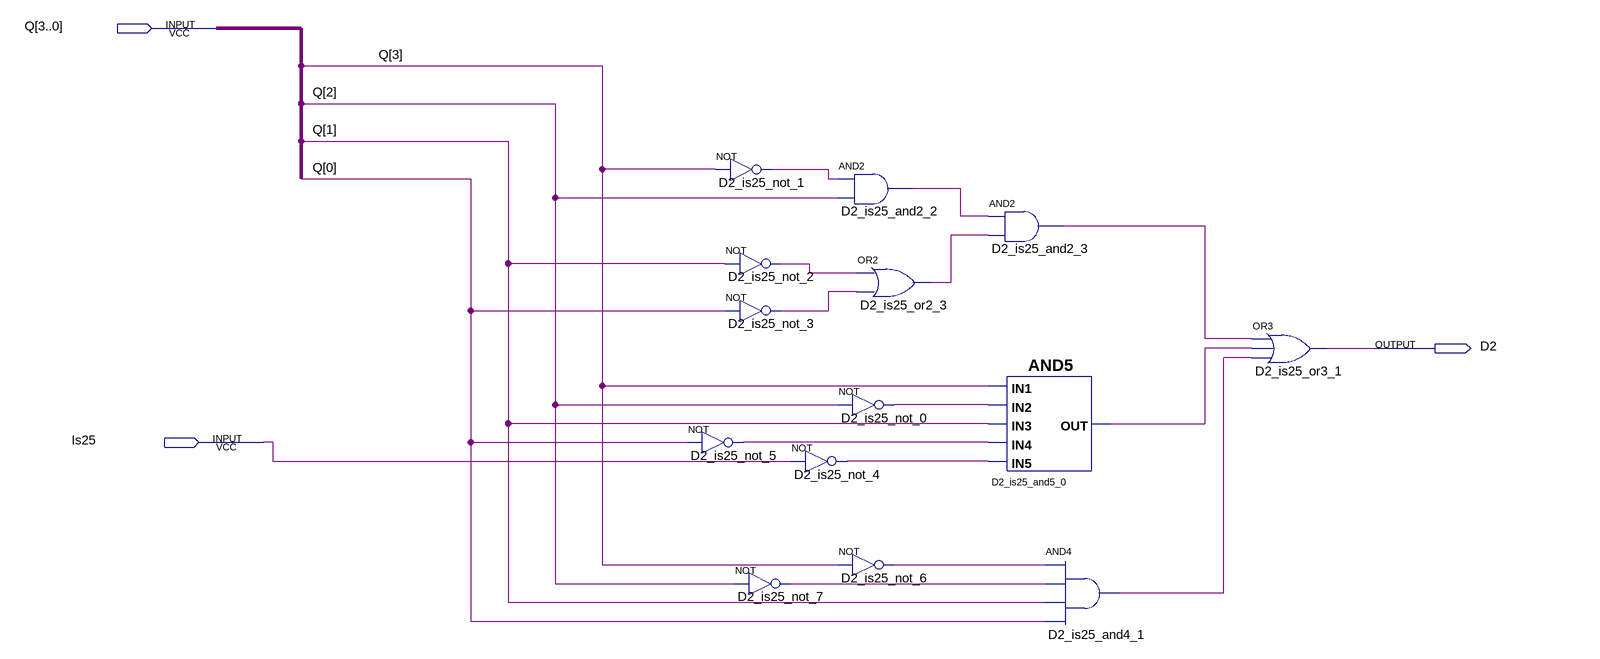
[diagram p0: schematic sheet]
// Quartus schematic D2.bdf as structural Verilog: 14 symbols, 3 pins
module D2 (
  input  [3:0] Q,
  input  Is25,
  output D2
);

  wire D2_is25_and2_2_out, D2_is25_and2_3_out, D2_is25_and4_1_out, D2_is25_and5_0_out, D2_is25_not_0_out,
       D2_is25_not_1_out, D2_is25_not_2_out, D2_is25_not_3_out, D2_is25_not_4_out, D2_is25_not_5_out,
       D2_is25_not_6_out, D2_is25_not_7_out, D2_is25_or2_3_out;

  not D2_is25_not_1 (D2_is25_not_1_out, Q[3]);
  not D2_is25_not_2 (D2_is25_not_2_out, Q[1]);
  not D2_is25_not_3 (D2_is25_not_3_out, Q[0]);
  not D2_is25_not_5 (D2_is25_not_5_out, Q[0]);
  not D2_is25_not_7 (D2_is25_not_7_out, Q[2]);
  not D2_is25_not_4 (D2_is25_not_4_out, Is25);
  and D2_is25_and2_2 (D2_is25_and2_2_out, D2_is25_not_1_out, Q[2]);
  or D2_is25_or2_3 (D2_is25_or2_3_out, D2_is25_not_2_out, D2_is25_not_3_out);
  not D2_is25_not_0 (D2_is25_not_0_out, Q[2]);
  not D2_is25_not_6 (D2_is25_not_6_out, Q[3]);
  and D2_is25_and2_3 (D2_is25_and2_3_out, D2_is25_and2_2_out, D2_is25_or2_3_out);
  and D2_is25_and5_0 (D2_is25_and5_0_out, Q[3], D2_is25_not_0_out, Q[1], D2_is25_not_5_out, D2_is25_not_4_out);
  and D2_is25_and4_1 (D2_is25_and4_1_out, D2_is25_not_6_out, D2_is25_not_7_out, Q[1], Q[0]);
  or D2_is25_or3_1 (D2, D2_is25_and2_3_out, D2_is25_and5_0_out, D2_is25_and4_1_out);
endmodule
